# EAGLE design improved-handheld-turbidimeter_TIA (EAGLE 7.6.0)
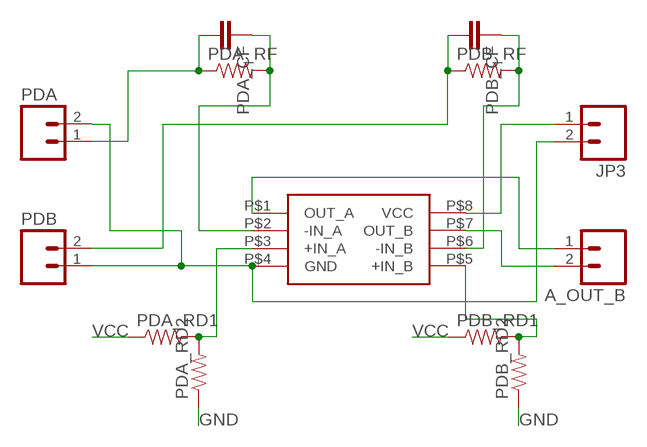
[diagram p0: schematic, sheet 1]

## Parts
A_OUT_B  M02PTH  [1X02]
JP3  M02PTH  [1X02]
PDA  M02PTH  [1X02]
PDA_CF  CAP0603-CAP  [0603-CAP]
PDA_RD1  RESISTOR0603-RES  [0603-RES]
PDA_RD2  RESISTOR0603-RES  [0603-RES]
PDA_RF  RESISTOR0603-RES  [0603-RES]
PDB  M02PTH  [1X02]
PDB_CF  CAP0603-CAP  [0603-CAP]
PDB_RD1  RESISTOR0603-RES  [0603-RES]
PDB_RD2  RESISTOR0603-RES  [0603-RES]
PDB_RF  RESISTOR0603-RES  [0603-RES]
U$2  ADA4528-2  [ADA4528-2]

## Nets
GND: JP3.2 PDA.2 PDA_RD2.1 PDB.1 PDB_RD2.1 U$2.P$4(GND)
N$1: PDA.1 PDA_CF.2 PDA_RF.1
N$2: PDA_CF.1 PDA_RF.2 U$2.P$2(-IN_A)
N$3: PDB.2 PDB_CF.2 PDB_RF.1
N$4: PDB_CF.1 PDB_RF.2 U$2.P$6(-IN_B)
N$5: PDA_RD1.2 PDA_RD2.2 U$2.P$3(+IN_A)
N$6: PDB_RD1.2 PDB_RD2.2 U$2.P$5(+IN_B)
OUTA: A_OUT_B.1 U$2.P$1(OUT_A)
OUTB: A_OUT_B.2 U$2.P$7(OUT_B)
VCC: JP3.1 PDA_RD1.1 PDB_RD1.1 U$2.P$8(VCC)

## Library data of the parts
A_OUT_B JP3 PDA PDB = SparkFun-Connectors:M02: Standard 2-pin 0.1" header. Use with - straight break away headers ( PRT-00116) - right angle break away headers (PRT-00553) - swiss pins (PRT-00743) - machine pins (PRT-00117) - female headers (PRT-00115) Molex polarized connector foot print use with: PRT-08233 with associated crimp pins and housings. 2.54_SCREWTERM for use with PRT-10571. 3.5mm Screw Terminal footprints for PRT-08084 5mm Screw Terminal footprints for use with PRT-08432
PDA_CF PDB_CF = SparkFun-Passives:CAP: Capacitor Standard 0603 ceramic capacitor, and 0.1" leaded capacitor.
PDA_RD1 PDA_RD2 PDA_RF PDB_RD1 PDB_RD2 PDB_RF = SparkFun-Passives:RESISTOR: Resistor Basic schematic elements and footprints for 0603, 1206, and PTH resistors.
U$2 = awqua_eagle_library:ADA4528-2

## Board
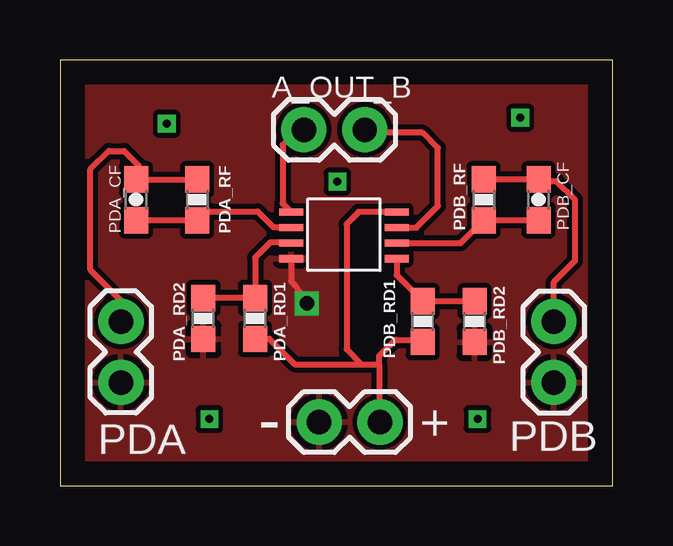
[diagram p1: board, top side]
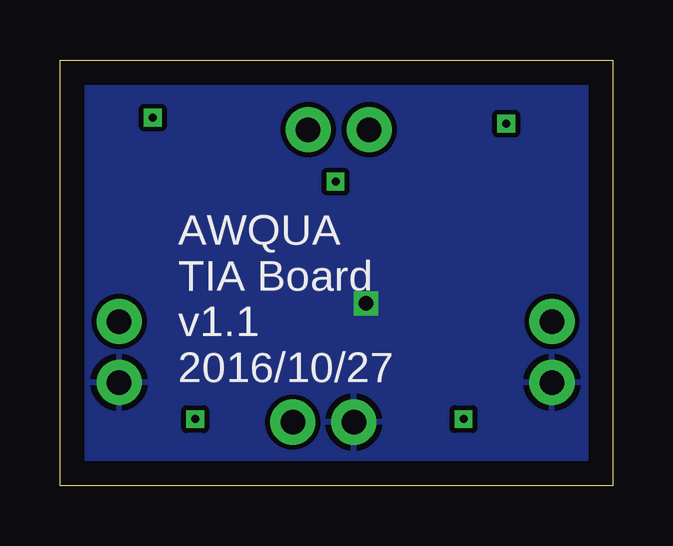
[diagram p2: board, bottom side, seen from below]

Size 23.04 x 17.77 mm. Coordinates in mm from the lower left corner, seen from the top.
Outline: 0,0 23.04,0 23.04,17.77 0,17.77 0,0
Copper layers (1*16): Top 0.035mm / dielectric 1.5mm / Bottom 0.035mm
Design rules "default *": minimum track width 10mil, minimum drill 24mil, track to track 8mil, track to pad 8mil, pad to pad 8mil, via to via 8mil, smd to smd 8mil, copper to edge 40mil, drill to drill 8mil, minimum pad ring 10mil, minimum via ring 8mil, stop-mask expansion 4mil, vias tented up to drill 15mil, thermal gap 10mil

### Footprints (pad centres in the part's own frame; a part is rotated, then mirrored left to right if it is on the bottom)
1X02 = drill 1.016 pad 1.88: 1 0,0; 2 2.54,0
0603-CAP = smd 1.1 x 1: 1 -0.85,0; 2 0.85,0
0603-RES = smd 1.1 x 1: 1 -0.85,0; 2 0.85,0
ADA4528-2 = smd 1 x 0.3: P$1 -0.7,2.45; P$2 -0.7,1.8; P$3 -0.7,1.15; P$4 -0.7,0.5; P$5 3.7,0.5; P$6 3.7,1.15; P$7 3.7,1.8; P$8 3.7,2.45

### Placement (x,y rotation side)
A_OUT_B  10.16,14.86 0 top
JP3  13.34,2.67 180 top
PDA  2.54,6.86 270 top
PDA_CF  3.17,11.94 90 top
PDA_RD1  8.13,6.99 90 top
PDA_RD2  5.97,6.99 90 top
PDA_RF  5.71,11.94 270 top
PDB  20.57,4.32 90 top
PDB_CF  19.94,11.94 90 top
PDB_RD1  15.11,6.86 90 top
PDB_RD2  17.27,6.86 90 top
PDB_RF  17.65,11.94 270 top
U$2  10.33,8.98 0 top

### Tracks (layer width: path | path; a pad name or v marks a point on that pad's centre or on a via)
GND  (via drill 0.6)
  Top 0.254: U$2.P$4 9.63,8.53 9.78,8.38 v10.29,7.62
  pour Bottom: -2.29,20.83 25.91,21.08 25.65,-2.79 -2.67,-3.05
  pour Top: -3.68,41.15 33.91,42.42 33.91,-5.59 -3.68,-5.59
N$1
  Top 0.254: PDA_RF.1 PDA_CF.2 3.3,12.91 3.3,13.34 2.67,13.97 2.03,13.97 1.27,13.21 1.27,9.02 2.54,7.75 PDA.1
N$2
  Top 0.254: PDA_CF.1 PDA_RF.2 6.08,11.45 8.23,11.45 8.89,10.79 9.61,10.79 U$2.P$2
N$3
  Top 0.254: PDB.2 20.57,8.51 21.46,9.4 21.46,11.94 20.7,12.7 20.03,12.7 PDB_CF.2 PDB_RF.1
N$4
  Top 0.254: 17.29,11.45 PDB_RF.2 | PDB_RF.2 PDB_CF.1 | U$2.P$6 16.7,10.13 PDB_RF.2
N$5
  Top 0.254: U$2.P$3 9.6,10.16 8.76,10.16 8.13,9.53 PDA_RD1.2 PDA_RD2.2
N$6
  Top 0.254: U$2.P$5 14.03,8.79 PDB_RD1.2 PDB_RD2.2
N$8  (via drill 0.33)
  other vias: 6.22,2.79
N$9  (via drill 0.33)
  other vias: 17.4,2.79
N$10  (via drill 0.33)
  other vias: 11.56,12.7
N$11  (via drill 0.33)
  other vias: 4.45,15.11
N$12  (via drill 0.33)
  other vias: 19.18,15.37
OUTA
  Top 0.254: A_OUT_B.1 9.91,14.86 9.27,14.22 9.27,11.79 U$2.P$1
OUTB
  Top 0.254: U$2.P$7 14.84,10.78 15.75,11.68 15.75,14.1 15.11,14.73 12.83,14.73 A_OUT_B.2
VCC
  Top 0.254: 12.57,5.08 9.78,5.08 8.72,6.13 PDA_RD1.1 | 12.57,5.08 13.3,5.08 | U$2.P$8 12.45,11.43 11.94,10.92 11.94,5.71 12.57,5.08 | 13.3,5.08 13.3,2.71 JP3.1 | 13.3,5.08 13.3,5.42 13.97,6.1 15.03,6.1 PDB_RD1.1

### Text on the board
tNames: - | +
bNames: AWQUA / TIA Board / v1.1 / 2016/10/27